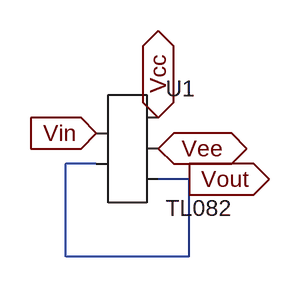
[diagram p0: schematic buffer.asc]
buffer.asc, the LTspice schematic file:
Version 4
SHEET 1 880 680
WIRE 160 176 128 176
WIRE 256 192 224 192
WIRE 128 272 128 176
WIRE 256 272 256 192
WIRE 256 272 128 272
FLAG 224 128 Vcc
IOPIN 224 128 BiDir
FLAG 224 160 Vee
IOPIN 224 160 BiDir
FLAG 160 144 Vin
IOPIN 160 144 In
FLAG 256 192 Vout
IOPIN 256 192 Out
SYMBOL AutoGenerated\\TL082 192 160 R0
SYMATTR InstName U1

The netlist it stands for:
* buffer.asc
* U1: TL082 (symbol AutoGenerated\TL082 not available, pins judged from their places): pin1=Vin pin2=Vout pin3=Vcc pin4=Vee pin5=Vout
.backanno
.end